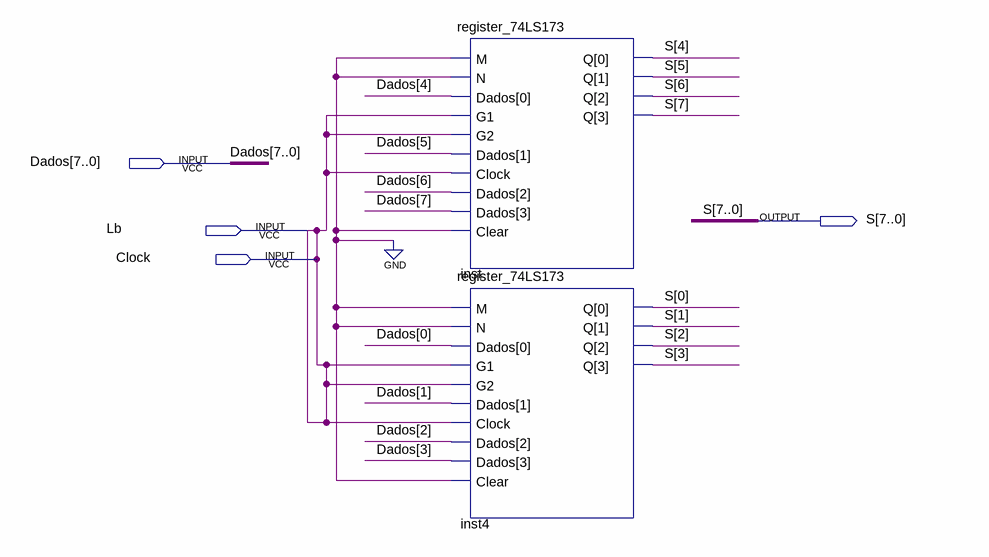
[diagram p0: schematic sheet]
// Quartus schematic register_b.bdf as structural Verilog: 2 symbols, 4 pins
module register_b (
  input  [7:0] Dados,
  input  Lb,
  input  Clock,
  output [7:0] S
);

  register_74LS173 inst (
    .M(1'b0), .N(1'b0), .Dados(Dados[7:4]), .G1(Clock), .G2(Clock), .Clock(Clock), .Clear(1'b0), .Q(S[7:4]));
  register_74LS173 inst4 (
    .M(1'b0), .N(1'b0), .Dados(Dados[3:0]), .G1(Clock), .G2(Clock), .Clock(Clock), .Clear(1'b0), .Q(S[3:0]));

  assign Lb = Clock;
endmodule
